# EAGLE schematic exo_sequencer (EAGLE 8.0.0)
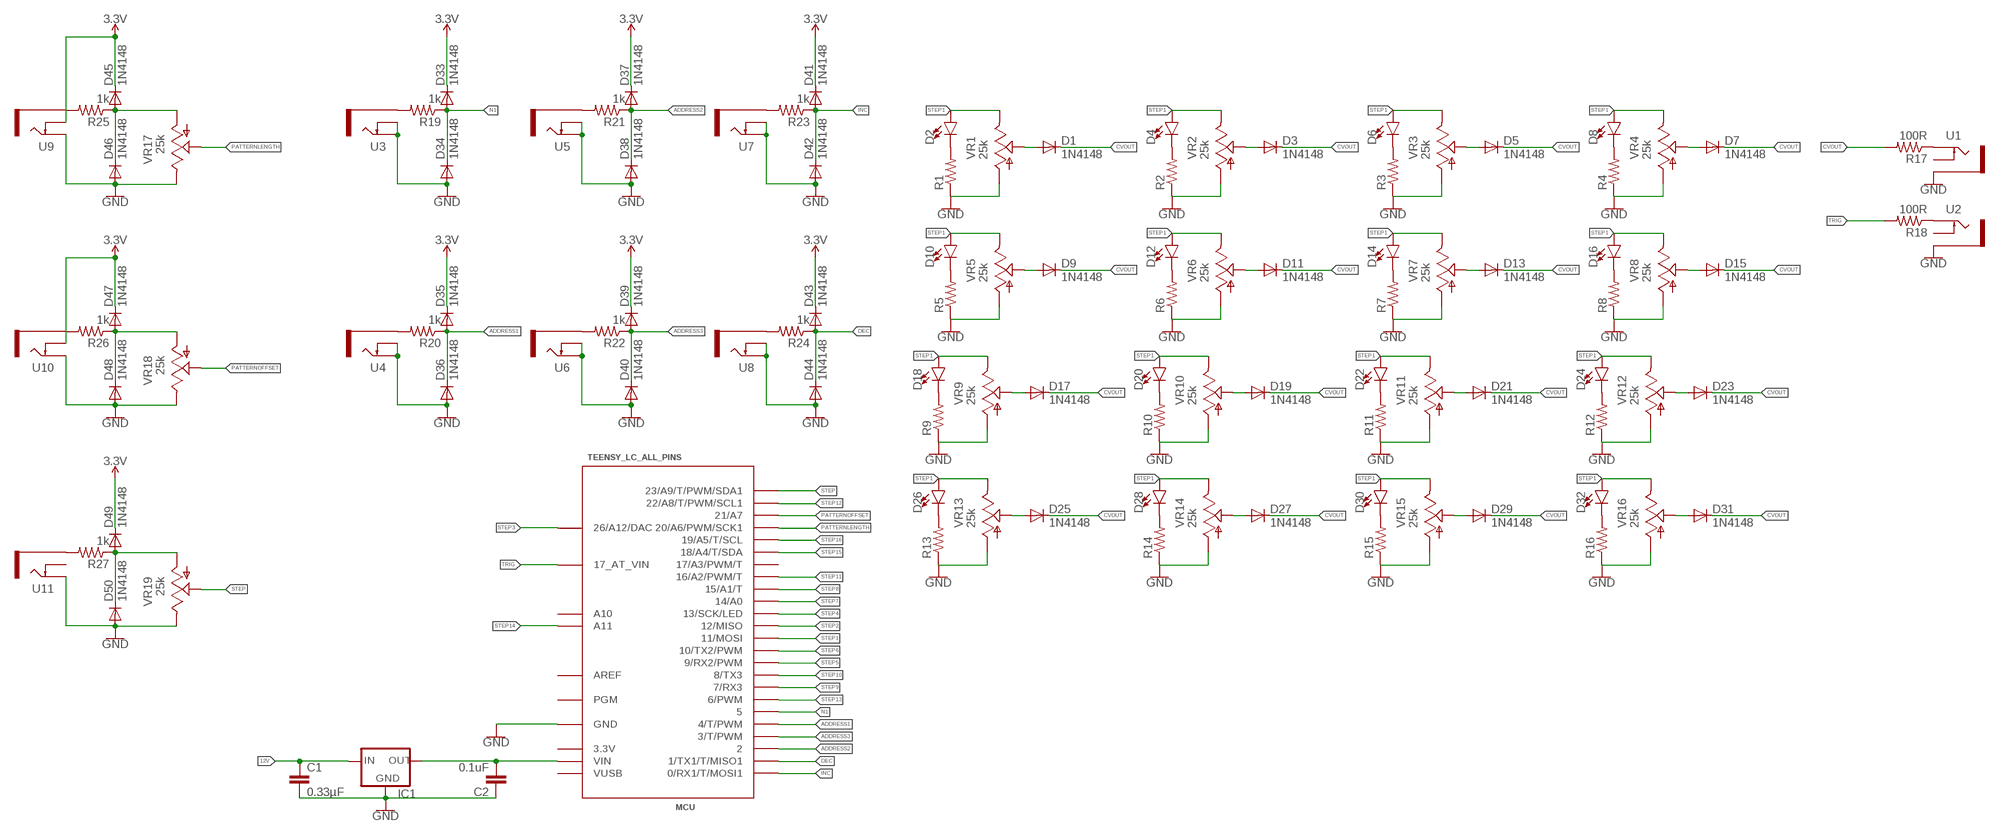
[diagram p0: schematic, sheet 1]

## Parts
C1  0.33µF  0.33UF/330NF-0805-50V-10%  [0805]
C2  0.1uF  0.1UF-0402-16V-10%  [0402]
D1  1N4148  SMALL_DIODEDO35-7  [DO35-7]
D2  LED-3MM-NO_SILK  [LED_3MM-NS]
D3  1N4148  SMALL_DIODEDO35-7  [DO35-7]
D4  LED-3MM-NO_SILK  [LED_3MM-NS]
D5  1N4148  SMALL_DIODEDO35-7  [DO35-7]
D6  LED-3MM-NO_SILK  [LED_3MM-NS]
D7  1N4148  SMALL_DIODEDO35-7  [DO35-7]
D8  LED-3MM-NO_SILK  [LED_3MM-NS]
D9  1N4148  SMALL_DIODEDO35-7  [DO35-7]
D10  LED-3MM-NO_SILK  [LED_3MM-NS]
D11  1N4148  SMALL_DIODEDO35-7  [DO35-7]
D12  LED-3MM-NO_SILK  [LED_3MM-NS]
D13  1N4148  SMALL_DIODEDO35-7  [DO35-7]
D14  LED-3MM-NO_SILK  [LED_3MM-NS]
D15  1N4148  SMALL_DIODEDO35-7  [DO35-7]
D16  LED-3MM-NO_SILK  [LED_3MM-NS]
D17  1N4148  SMALL_DIODEDO35-7  [DO35-7]
D18  LED-3MM-NO_SILK  [LED_3MM-NS]
D19  1N4148  SMALL_DIODEDO35-7  [DO35-7]
D20  LED-3MM-NO_SILK  [LED_3MM-NS]
D21  1N4148  SMALL_DIODEDO35-7  [DO35-7]
D22  LED-3MM-NO_SILK  [LED_3MM-NS]
D23  1N4148  SMALL_DIODEDO35-7  [DO35-7]
D24  LED-3MM-NO_SILK  [LED_3MM-NS]
D25  1N4148  SMALL_DIODEDO35-7  [DO35-7]
D26  LED-3MM-NO_SILK  [LED_3MM-NS]
D27  1N4148  SMALL_DIODEDO35-7  [DO35-7]
D28  LED-3MM-NO_SILK  [LED_3MM-NS]
D29  1N4148  SMALL_DIODEDO35-7  [DO35-7]
D30  LED-3MM-NO_SILK  [LED_3MM-NS]
D31  1N4148  SMALL_DIODEDO35-7  [DO35-7]
D32  LED-3MM-NO_SILK  [LED_3MM-NS]
D33  1N4148  SMALL_DIODEDO35-7  [DO35-7]
D34  1N4148  SMALL_DIODEDO35-7  [DO35-7]
D35  1N4148  SMALL_DIODEDO35-7  [DO35-7]
D36  1N4148  SMALL_DIODEDO35-7  [DO35-7]
D37  1N4148  SMALL_DIODEDO35-7  [DO35-7]
D38  1N4148  SMALL_DIODEDO35-7  [DO35-7]
D39  1N4148  SMALL_DIODEDO35-7  [DO35-7]
D40  1N4148  SMALL_DIODEDO35-7  [DO35-7]
D41  1N4148  SMALL_DIODEDO35-7  [DO35-7]
D42  1N4148  SMALL_DIODEDO35-7  [DO35-7]
D43  1N4148  SMALL_DIODEDO35-7  [DO35-7]
D44  1N4148  SMALL_DIODEDO35-7  [DO35-7]
D45  1N4148  SMALL_DIODEDO35-7  [DO35-7]
D46  1N4148  SMALL_DIODEDO35-7  [DO35-7]
D47  1N4148  SMALL_DIODEDO35-7  [DO35-7]
D48  1N4148  SMALL_DIODEDO35-7  [DO35-7]
D49  1N4148  SMALL_DIODEDO35-7  [DO35-7]
D50  1N4148  SMALL_DIODEDO35-7  [DO35-7]
IC1  78MXXL  [78MXXL]
MCU  TEENSY_LC_ALL_PINS  [TEENSY_3.0-3.2&LC_ALL_PINS]
R1  R-US_0204/7  [0204/7]
R2  R-US_0204/7  [0204/7]
R3  R-US_0204/7  [0204/7]
R4  R-US_0204/7  [0204/7]
R5  R-US_0204/7  [0204/7]
R6  R-US_0204/7  [0204/7]
R7  R-US_0204/7  [0204/7]
R8  R-US_0204/7  [0204/7]
R9  R-US_0204/7  [0204/7]
R10  R-US_0204/7  [0204/7]
R11  R-US_0204/7  [0204/7]
R12  R-US_0204/7  [0204/7]
R13  R-US_0204/7  [0204/7]
R14  R-US_0204/7  [0204/7]
R15  R-US_0204/7  [0204/7]
R16  R-US_0204/7  [0204/7]
R17  100R  R-US_0204/7  [0204/7]
R18  100R  R-US_0204/7  [0204/7]
R19  1k  R-US_0204/7  [0204/7]
R20  1k  R-US_0204/7  [0204/7]
R21  1k  R-US_0204/7  [0204/7]
R22  1k  R-US_0204/7  [0204/7]
R23  1k  R-US_0204/7  [0204/7]
R24  1k  R-US_0204/7  [0204/7]
R25  1k  R-US_0204/7  [0204/7]
R26  1k  R-US_0204/7  [0204/7]
R27  1k  R-US_0204/7  [0204/7]
U1  THONKICONNNEW  [WQP-PJ301M-12_JACK]
U2  THONKICONNNEW  [WQP-PJ301M-12_JACK]
U3  THONKICONNNEW  [WQP-PJ301M-12_JACK]
U4  THONKICONNNEW  [WQP-PJ301M-12_JACK]
U5  THONKICONNNEW  [WQP-PJ301M-12_JACK]
U6  THONKICONNNEW  [WQP-PJ301M-12_JACK]
U7  THONKICONNNEW  [WQP-PJ301M-12_JACK]
U8  THONKICONNNEW  [WQP-PJ301M-12_JACK]
U9  THONKICONNNEW  [WQP-PJ301M-12_JACK]
U10  THONKICONNNEW  [WQP-PJ301M-12_JACK]
U11  THONKICONNNEW  [WQP-PJ301M-12_JACK]
VR1  25k  9MM_SNAP-IN_POT_  [9MM_SNAP-IN_POT]
VR2  25k  9MM_SNAP-IN_POT_  [9MM_SNAP-IN_POT]
VR3  25k  9MM_SNAP-IN_POT_  [9MM_SNAP-IN_POT]
VR4  25k  9MM_SNAP-IN_POT_  [9MM_SNAP-IN_POT]
VR5  25k  9MM_SNAP-IN_POT_  [9MM_SNAP-IN_POT]
VR6  25k  9MM_SNAP-IN_POT_  [9MM_SNAP-IN_POT]
VR7  25k  9MM_SNAP-IN_POT_  [9MM_SNAP-IN_POT]
VR8  25k  9MM_SNAP-IN_POT_  [9MM_SNAP-IN_POT]
VR9  25k  9MM_SNAP-IN_POT_  [9MM_SNAP-IN_POT]
VR10  25k  9MM_SNAP-IN_POT_  [9MM_SNAP-IN_POT]
VR11  25k  9MM_SNAP-IN_POT_  [9MM_SNAP-IN_POT]
VR12  25k  9MM_SNAP-IN_POT_  [9MM_SNAP-IN_POT]
VR13  25k  9MM_SNAP-IN_POT_  [9MM_SNAP-IN_POT]
VR14  25k  9MM_SNAP-IN_POT_  [9MM_SNAP-IN_POT]
VR15  25k  9MM_SNAP-IN_POT_  [9MM_SNAP-IN_POT]
VR16  25k  9MM_SNAP-IN_POT_  [9MM_SNAP-IN_POT]
VR17  25k  9MM_SNAP-IN_POT_  [9MM_SNAP-IN_POT]
VR18  25k  9MM_SNAP-IN_POT_  [9MM_SNAP-IN_POT]
VR19  25k  9MM_SNAP-IN_POT_  [9MM_SNAP-IN_POT]

## Nets
3.3V: D33.C D35.C D37.C D39.C D41.C D43.C D45.C D47.C D49.C U9.P$2_SWITCH(SWITCH) U10.P$2_SWITCH(SWITCH)
12V: C1.1 IC1.IN
ADDRESS1: D35.A D36.C MCU.4(4/T/PWM) R20.1
ADDRESS2: D37.A D38.C MCU.2 R21.1
ADDRESS3: D39.A D40.C MCU.3(3/T/PWM) R22.1
CVOUT: D1.C D3.C D5.C D7.C D9.C D11.C D13.C D15.C D17.C D19.C D21.C D23.C D25.C D27.C D29.C D31.C R17.2
DEC: D43.A D44.C MCU.1(1/TX1/T/MISO1) R24.1
GND: C1.2 C2.1 D34.A D36.A D38.A D40.A D42.A D44.A D46.A D48.A D50.A IC1.GND MCU.AGND(GND) MCU.GND MCU.GND1(GND) R1.1 R2.1 R3.1 R4.1 R5.1 R6.1 R7.1 R8.1 R9.1 R10.1 R11.1 R12.1 R13.1 R14.1 R15.1 R16.1 U1.P$3_SLEEVE(SLEEVE) U2.P$3_SLEEVE(SLEEVE) U3.P$1_TIP(TIP) U3.P$2_SWITCH(SWITCH) U4.P$1_TIP(TIP) U4.P$2_SWITCH(SWITCH) U5.P$1_TIP(TIP) U5.P$2_SWITCH(SWITCH) U6.P$1_TIP(TIP) U6.P$2_SWITCH(SWITCH) U7.P$1_TIP(TIP) U7.P$2_SWITCH(SWITCH) U8.P$1_TIP(TIP) U8.P$2_SWITCH(SWITCH) U9.P$1_TIP(TIP) U10.P$1_TIP(TIP) U11.P$1_TIP(TIP) VR1.1(A) VR2.1(A) VR3.1(A) VR4.1(A) VR5.1(A) VR6.1(A) VR7.1(A) VR8.1(A) VR9.1(A) VR10.1(A) VR11.1(A) VR12.1(A) VR13.1(A) VR14.1(A) VR15.1(A) VR16.1(A) VR17.3(E) VR18.3(E) VR19.3(E)
INC: D41.A D42.C MCU.0(0/RX1/T/MOSI1) R23.1
N1: D33.A D34.C D45.A D46.C MCU.5 R19.1 R25.1 VR17.1(A)
N2: D47.A D48.C R26.1 VR18.1(A)
N3: D49.A D50.C R27.1 VR19.1(A)
N$1: D2.K(C) R1.2
N$2: D4.K(C) R2.2
N$3: D1.A VR1.2(S)
N$4: D3.A VR2.2(S)
N$5: D6.K(C) R3.2
N$6: D5.A VR3.2(S)
N$7: D8.K(C) R4.2
N$8: D7.A VR4.2(S)
N$9: D10.K(C) R5.2
N$10: D9.A VR5.2(S)
N$11: D12.K(C) R6.2
N$12: D11.A VR6.2(S)
N$13: D14.K(C) R7.2
N$14: D13.A VR7.2(S)
N$15: D16.K(C) R8.2
N$16: D15.A VR8.2(S)
N$17: D18.K(C) R9.2
N$18: D17.A VR9.2(S)
N$19: D20.K(C) R10.2
N$20: D19.A VR10.2(S)
N$21: D22.K(C) R11.2
N$22: D21.A VR11.2(S)
N$23: D24.K(C) R12.2
N$24: D23.A VR12.2(S)
N$25: D26.K(C) R13.2
N$26: D25.A VR13.2(S)
N$27: D28.K(C) R14.2
N$28: D27.A VR14.2(S)
N$29: D30.K(C) R15.2
N$30: D29.A VR15.2(S)
N$31: D32.K(C) R16.2
N$32: D31.A VR16.2(S)
N$33: R18.1 U2.P$1_TIP(TIP)
N$34: R17.1 U1.P$1_TIP(TIP)
N$35: R19.2 U3.P$3_SLEEVE(SLEEVE)
N$36: R20.2 U4.P$3_SLEEVE(SLEEVE)
N$37: R21.2 U5.P$3_SLEEVE(SLEEVE)
N$38: R22.2 U6.P$3_SLEEVE(SLEEVE)
N$39: R23.2 U7.P$3_SLEEVE(SLEEVE)
N$40: R24.2 U8.P$3_SLEEVE(SLEEVE)
N$41: R25.2 U9.P$3_SLEEVE(SLEEVE)
N$42: R26.2 U10.P$3_SLEEVE(SLEEVE)
N$43: R27.2 U11.P$3_SLEEVE(SLEEVE)
N$44: C2.2 IC1.OUT MCU.VIN
PATTERNLENGTH: MCU.20/A6(20/A6/PWM/SCK1) VR17.2(S)
PATTERNOFFSET: MCU.21/A7 VR18.2(S)
STEP: MCU.23/A9(23/A9/T/PWM/SDA1) VR19.2(S)
STEP1: D2.A D4.A D6.A D8.A D10.A D12.A D14.A D16.A D18.A D20.A D22.A D24.A D26.A D28.A D30.A D32.A MCU.11(11/MOSI) VR1.3(E) VR2.3(E) VR3.3(E) VR4.3(E) VR5.3(E) VR6.3(E) VR7.3(E) VR8.3(E) VR9.3(E) VR10.3(E) VR11.3(E) VR12.3(E) VR13.3(E) VR14.3(E) VR15.3(E) VR16.3(E)
STEP2: MCU.12(12/MISO)
STEP3: MCU.RESET/DAC(26/A12/DAC)
STEP4: MCU.13(13/SCK/LED)
STEP5: MCU.9(9/RX2/PWM)
STEP6: MCU.10(10/TX2/PWM)
STEP7: MCU.14/A0
STEP8: MCU.15/A1(15/A1/T)
STEP9: MCU.7(7/RX3)
STEP10: MCU.8(8/TX3)
STEP11: MCU.16/A2(16/A2/PWM/T)
STEP12: MCU.22/A8(22/A8/T/PWM/SCL1)
STEP13: MCU.6(6/PWM)
STEP14: MCU.A11
STEP15: MCU.18/A4(18/A4/T/SDA)
STEP16: MCU.19/A5(19/A5/T/SCL)
TRIG: MCU.VBAT(17_AT_VIN) R18.2
Unconnected: MCU.17/A3(17/A3/PWM/T) MCU.A10 MCU.PGM U1.P$2_SWITCH(SWITCH) U2.P$2_SWITCH(SWITCH) U11.P$2_SWITCH(SWITCH)

## Power pins joined to a net without a drawn wire
3.3V: MCU.3.3V MCU.3.3V1(3.3V)
AREF: MCU.AREF
VUSB: MCU.VUSB

## Library data of the parts
C1 = SparkFun-Capacitors:0.33UF/330NF: 0.33µF/330nF ceramic capacitors A capacitor is a passive two-terminal electrical component used to store electrical energy temporarily in an electric field.; PROD_ID: CAP-08469
C2 = SparkFun-Capacitors:0.1UF: 0.1µF ceramic capacitors A capacitor is a passive two-terminal electrical component used to store electrical energy temporarily in an electric field.; PROD_ID: CAP-12416
D1 D3 D5 D7 D9 D11 D13 D15 D17 D19 D21 D23 D25 D27 D29 D31 D33-D50 = MusicThingModular:SMALL_DIODE: Small Signal Diode
D2 D4 D6 D8 D10 D12 D14 D16 D18 D20 D22 D24 D26 D28 D30 D32 = SparkFun-LED:LED: LED (Generic) Standard schematic elements and footprints for 5mm, 3mm, 1206, and 0603 sized LEDs. Generic LEDs with no color specified.
IC1 = v-reg:78MXXL: VOLTAGE REGULATOR
MCU = Teensy_3_and_LC_Series_Boards_v1.4:TEENSY_LC_ALL_PINS: Teensy LC board with all pins used.
R1-R27 = rcl:R-US_: RESISTOR, American symbol
U1-U11 = MusicThingModular:THONKICONN: 3.5mm socket for Eurorack modular synths
VR1-VR19 = MusicThingModular:9MM_SNAP-IN_POT: 9mm vertical snap-in pot, Alpha / Panasonic style